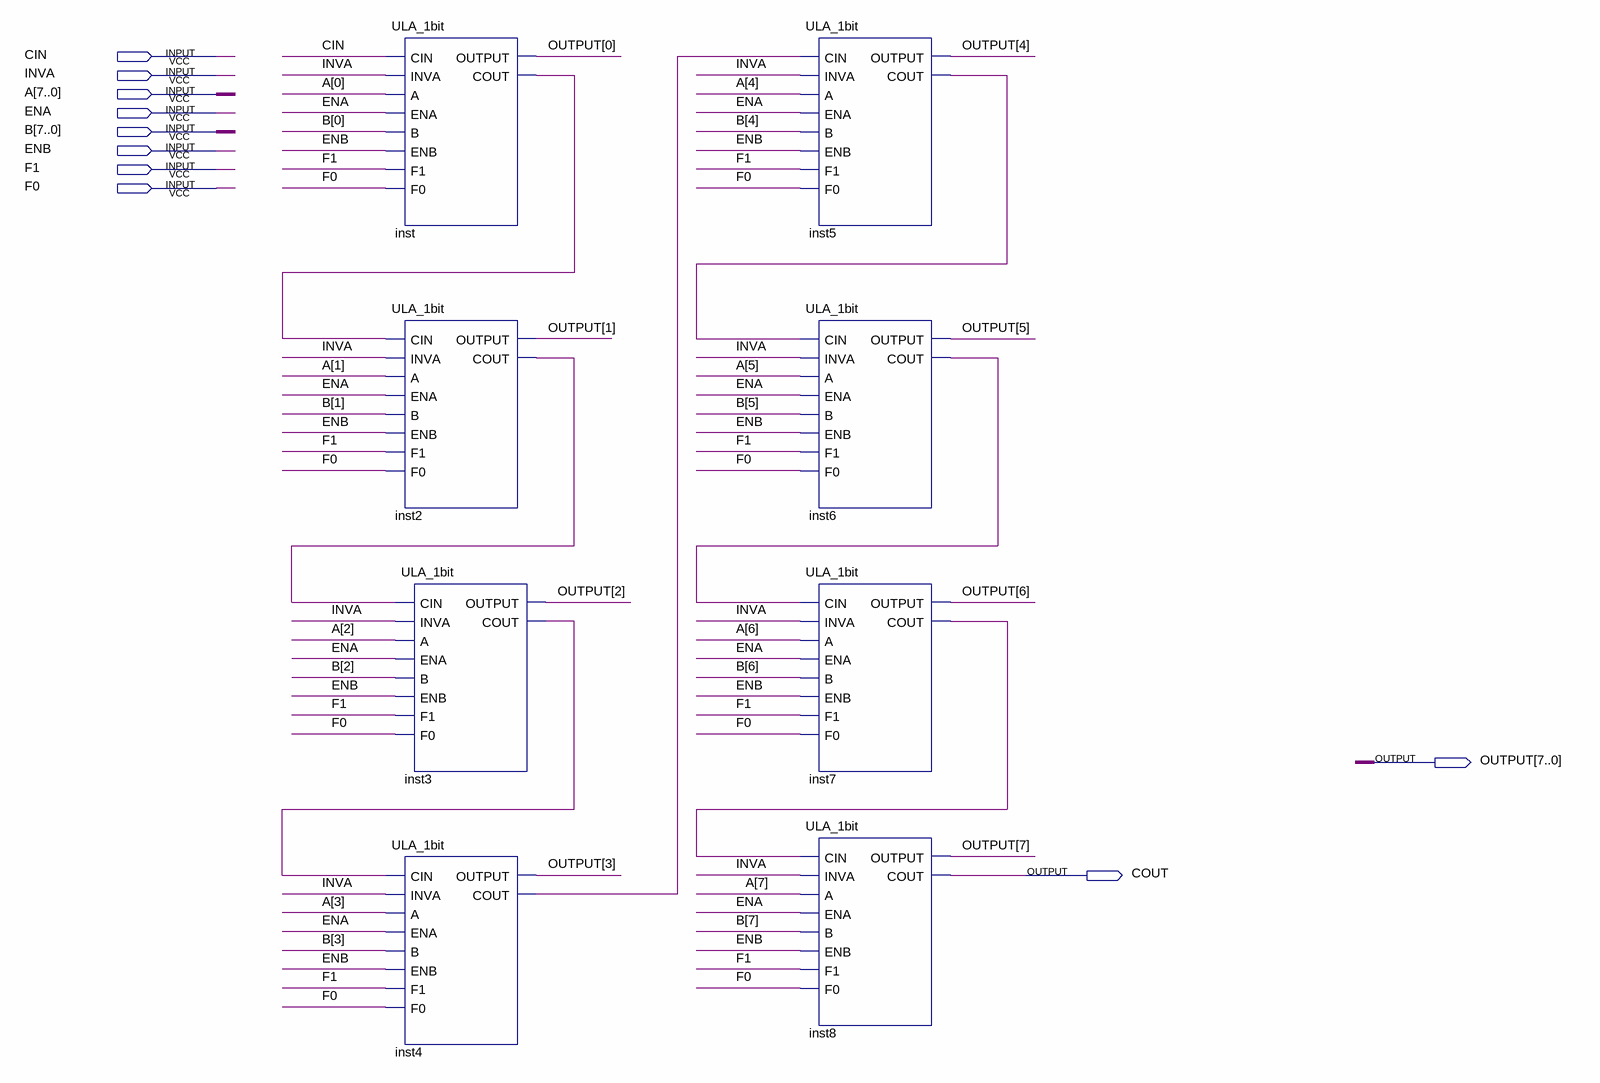
[diagram p0: schematic sheet]
// Quartus schematic ULA_8bit.bdf as structural Verilog: 8 symbols, 10 pins
module ULA_8bit (
  input  CIN,
  input  INVA,
  input  [7:0] A,
  input  ENA,
  input  [7:0] B,
  input  ENB,
  input  F1,
  input  F0,
  output [7:0] OUTPUT,
  output COUT
);

  wire inst2_cout, inst3_cout, inst4_cout, inst5_cout, inst6_cout, inst7_cout, inst_cout;

  ULA_1bit inst (
    .CIN(CIN), .INVA(INVA), .A(A[0]), .ENA(ENA), .B(B[0]), .ENB(ENB), .F1(F1), .F0(F0), .OUTPUT(OUTPUT[0]),
    .COUT(inst_cout));
  ULA_1bit inst2 (
    .CIN(inst_cout), .INVA(INVA), .A(A[1]), .ENA(ENA), .B(B[1]), .ENB(ENB), .F1(F1), .F0(F0),
    .OUTPUT(OUTPUT[1]), .COUT(inst2_cout));
  ULA_1bit inst3 (
    .CIN(inst2_cout), .INVA(INVA), .A(A[2]), .ENA(ENA), .B(B[2]), .ENB(ENB), .F1(F1), .F0(F0),
    .OUTPUT(OUTPUT[2]), .COUT(inst3_cout));
  ULA_1bit inst4 (
    .CIN(inst3_cout), .INVA(INVA), .A(A[3]), .ENA(ENA), .B(B[3]), .ENB(ENB), .F1(F1), .F0(F0),
    .OUTPUT(OUTPUT[3]), .COUT(inst4_cout));
  ULA_1bit inst5 (
    .CIN(inst4_cout), .INVA(INVA), .A(A[4]), .ENA(ENA), .B(B[4]), .ENB(ENB), .F1(F1), .F0(F0),
    .OUTPUT(OUTPUT[4]), .COUT(inst5_cout));
  ULA_1bit inst6 (
    .CIN(inst5_cout), .INVA(INVA), .A(A[5]), .ENA(ENA), .B(B[5]), .ENB(ENB), .F1(F1), .F0(F0),
    .OUTPUT(OUTPUT[5]), .COUT(inst6_cout));
  ULA_1bit inst7 (
    .CIN(inst6_cout), .INVA(INVA), .A(A[6]), .ENA(ENA), .B(B[6]), .ENB(ENB), .F1(F1), .F0(F0),
    .OUTPUT(OUTPUT[6]), .COUT(inst7_cout));
  ULA_1bit inst8 (
    .CIN(inst7_cout), .INVA(INVA), .A(A[7]), .ENA(ENA), .B(B[7]), .ENB(ENB), .F1(F1), .F0(F0),
    .OUTPUT(OUTPUT[7]), .COUT(COUT));
endmodule
